# Altium project AulaPS.PrjPcb
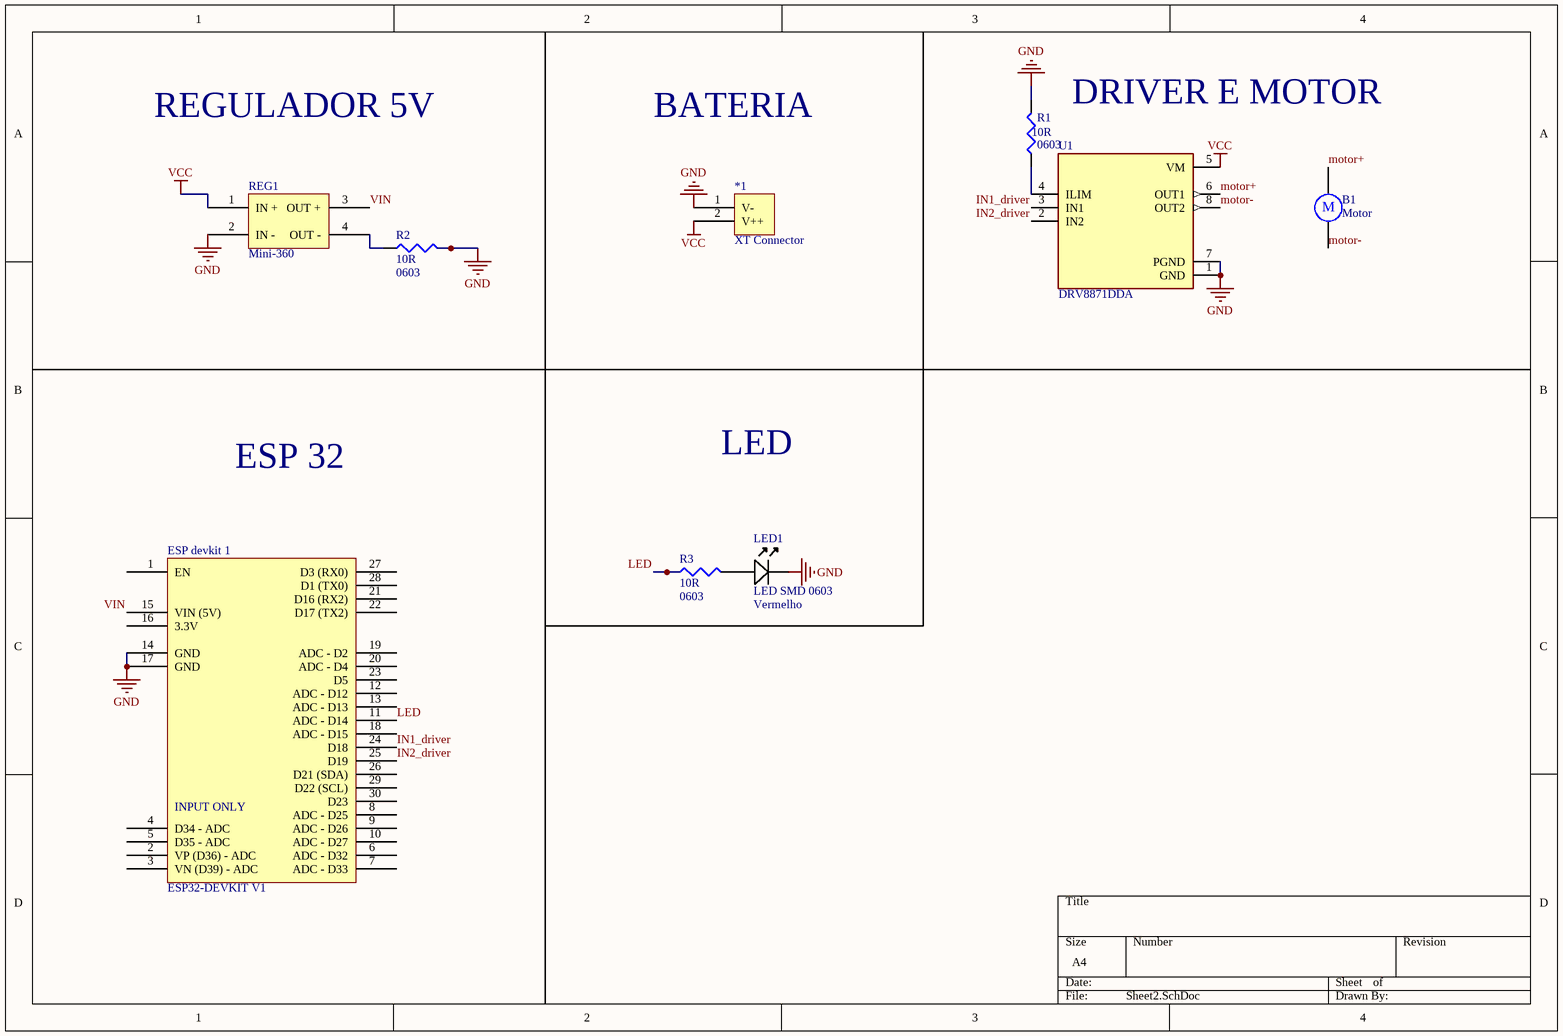
[diagram p0: Sheet2.SchDoc]
2 sheets, 9 parts. Net scope: global (net labels, ports and power ports of the same name join across sheets).
Board file: PCB1.PcbDoc
Sheets:
  Sheet1.SchDoc
  Sheet2.SchDoc

## Sheet Sheet1.SchDoc
size A4; SheetNumber: 1; SheetTotal: 1

## Sheet Sheet2.SchDoc
size A4; SheetNumber: 2; SheetTotal: 2

### Parts
*1  XT Connector  [XT90]
B1  Motor  [Motor]
ESP_devkit_1  ESP32-DEVKIT V1  [ESP32-DEVKIT V1]
LED1  LED SMD 0603  Cor: Vermelho  [LED SMD 0603 Vermelho]
R1  value 10R  Size: 0603  [Resistor SMD 0603]  (hidden comment: Resistor SMD)
R2  value 10R  Size: 0603  [Resistor SMD 0603]  (hidden comment: Resistor SMD)
R3  value 10R  Size: 0603  [Resistor SMD 0603]  (hidden comment: Resistor SMD)
REG1  Mini-360  [Mini-360]
U1  DRV8871DDA  [DRV8871DDAR]

### Nets
GND: *1.1(V-) ESP_devkit_1.14(GND) ESP_devkit_1.17(GND) LED1.K R1.2 R2.2 REG1.2(IN_-) U1.1(GND) U1.7(PGND)
VCC: *1.2(V++) REG1.1(IN_+) U1.5(VM)
IN1_driver: ESP_devkit_1.24(D18) U1.3(IN1)
IN2_driver: ESP_devkit_1.25(D19) U1.2(IN2)
LED: ESP_devkit_1.11(ADC_-_D14) R3.1
motor+: B1.1 U1.6(OUT1)
motor-: B1.2 U1.8(OUT2)
VIN: ESP_devkit_1.15(VIN_(5V)) REG1.3(OUT_+)
NetLED1_A: LED1.A R3.2
NetR1_1: R1.1 U1.4(ILIM)
NetR2_1: R2.1 REG1.4(OUT_-)

Not connected (* = marked no-connect by the designer): ESP_devkit_1 1(EN) 2(VP_(D36)_-_ADC) 3(VN_(D39)_-_ADC) 4(D34_-_ADC) 5(D35_-_ADC) 6(ADC_-_D32) 7(ADC_-_D33) 8(ADC_-_D25) 9(ADC_-_D26) 10(ADC_-_D27) 12(ADC_-_D12) 13(ADC_-_D13) 16(3.3V) 18(ADC_-_D15) 19(ADC_-_D2) 20(ADC_-_D4) 21(D16_(RX2)) 22(D17_(TX2)) 23(D5) 26(D21_(SDA)) 27(D3_(RX0)) 28(D1_(TX0)) 29(D22_(SCL)) 30(D23)

### Notes on the sheet
- DRIVER E MOTOR
- REGULADOR 5V
- BATERIA
- ESP 32
- LED
- (in symbol ESP32-DEVKIT V1) INPUT ONLY
- (in symbol Motor) M

### Library data of the parts
B1 = Motor: Motor, General Kind; Published: 24-Mar-1999; LatestRevisionDate: 17-Jul-2002; LatestRevisionNote: Re-released for DXP Platform.; PackageReference: RB5-10.5; Publisher: Altium Limited; PackageDescription: Capacitor (Radial); 2 Leads
ESP_devkit_1 = ESP32-DEVKIT V1: Placa ESP32 com 30 pinos - Modelo DEVKIT V1
LED1 = LED SMD 0603: Diodo emissor de luz SMD 0603
R1-R3 = Resistor SMD: Resistor SMD com os tamanhos 0603, 0805, 1206 e 1210
REG1 = Mini-360: Módulo Regulador de Tensão Step Down Buck DC-DC Mini 360 3A
U1 = DRV8871DDA: 45-V, 3.6-A H-bridge motor driver with integrated current sensing 8-SO PowerPAD -40 to 125; MF: Texas Instruments; Mouser-Purchase-URL: https://snapeda.com/shop?store=Mouser&id=547750; SnapEDA_Link: https://www.snapeda.com/parts/DRV8871DDA/Texas%20Instruments/view-part/547750/?ref=snap; DigiKey-Purchase-URL: https://snapeda.com/shop?store=DigiKey&id=547750; Arrow_Electronics-Purchase-URL: https://snapeda.com/shop?store=Arrow+Electronics&id=547750; MP: DRV8871DDA; Texas_Instruments-Purchase-URL: https://snapeda.com/shop?store=Texas+Instruments&id=547750; Availability: Good; Price: None; Value: *; Package: HSOIC-8 Texas Instruments